# Altium schematic sheet Pack_monitoring.SchDoc
size 279 x 215 mm; Engineer: Andrew Chai; Revision: 1
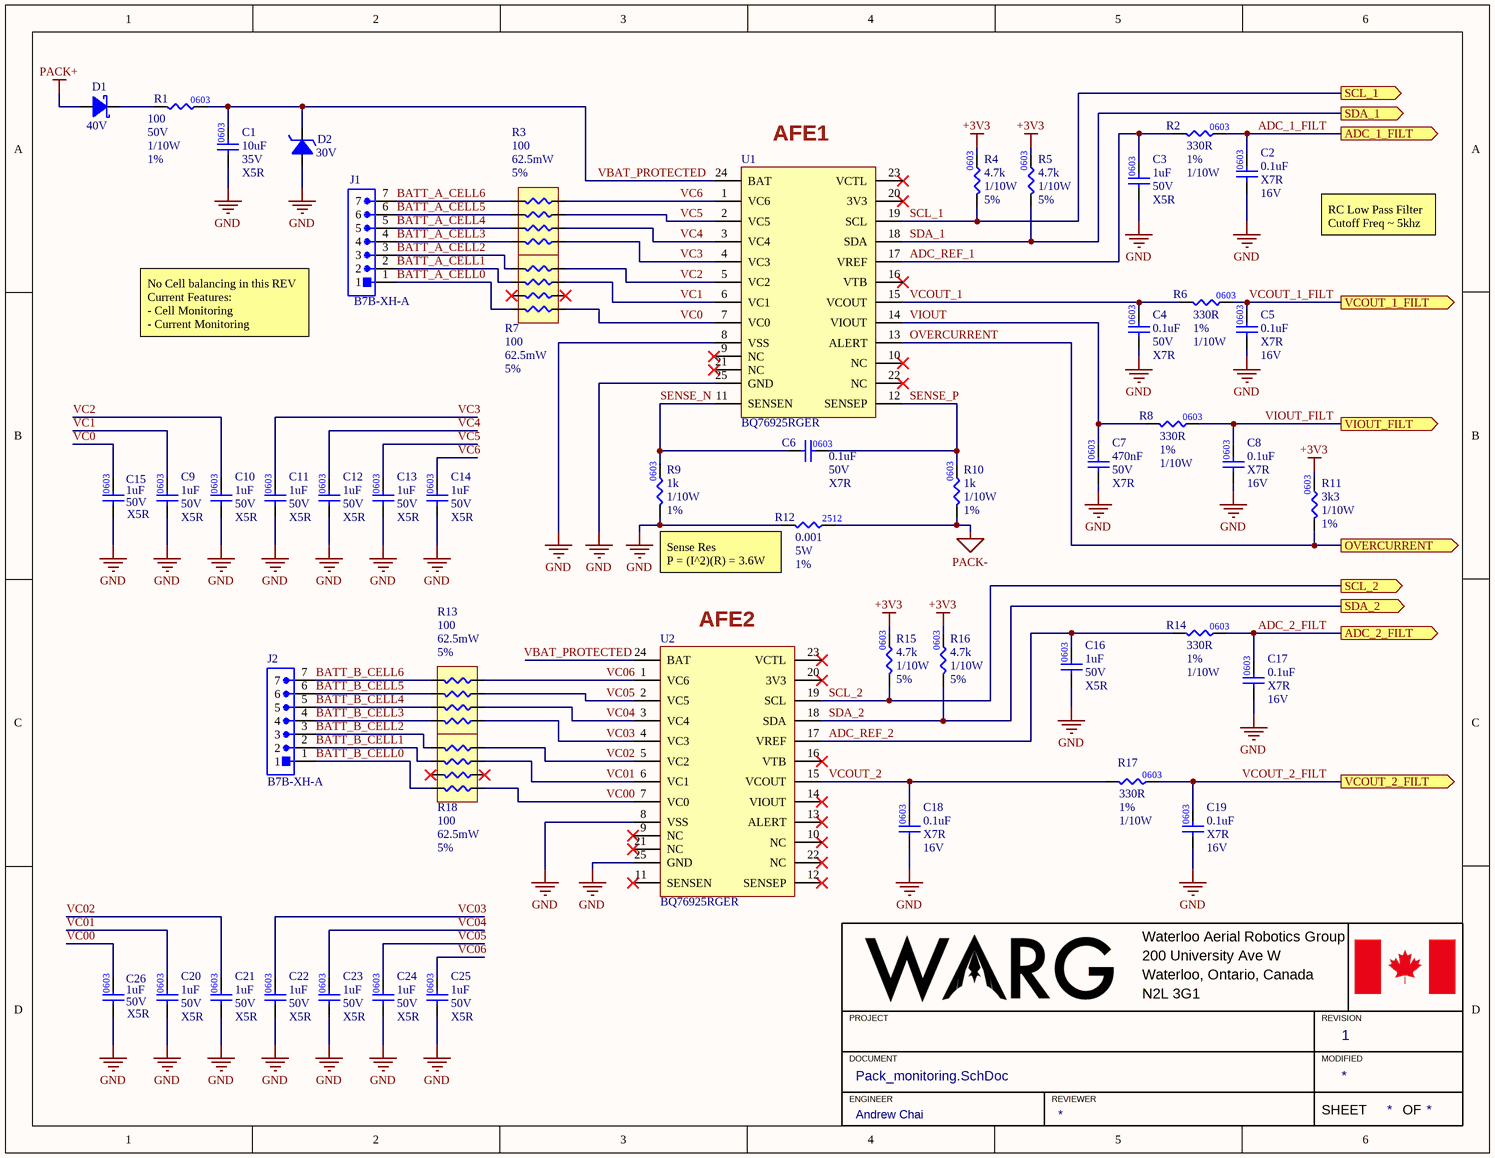
[diagram p0: Pack_monitoring.SchDoc]

## Parts
C1  value 10uF  Rated DC Voltage (URdc): 35V  Temperature Characteristics Code: X5R  [.CAP_0603-Footprint-1]  (hidden comment: GRM188R6YA106MA73J)
C2  value 0.1uF  Temperature Coefficient: X7R  Voltage: 16V  [.CAP_0603-Footprint-1]  (hidden comment: GCM188R71C104KA37D)
C3  value 1uF  Voltage Rating: 50V  Temperature Characteristics Code: X5R  [.CAP_0603-Footprint-1]  (hidden comment: GRT188R61H105KE13D)
C4  Voltage: 50V  Dielectric: X7R  Capacitance: 0.1uF  [CAP0603]  (hidden comment: GCM188R71H104KA57D)
C5  value 0.1uF  Temperature Coefficient: X7R  Voltage: 16V  [.CAP_0603-Footprint-1]  (hidden comment: GCM188R71C104KA37D)
C6  Voltage: 50V  Dielectric: X7R  Capacitance: 0.1uF  [CAP0603]  (hidden comment: GCM188R71H104KA57D)
C7  Dielectric: X7R  Capacitance: 470nF  Voltage Rating: 50V  [FP-0603-L_1_6_0_1-W_0_8_0-IPC_A]  (hidden comment: UMK107B7474KA-TR)
C8  value 0.1uF  Temperature Coefficient: X7R  Voltage: 16V  [.CAP_0603-Footprint-1]  (hidden comment: GCM188R71C104KA37D)
C9  value 1uF  Voltage Rating: 50V  Temperature Characteristics Code: X5R  [.CAP_0603-Footprint-1]  (hidden comment: GRT188R61H105KE13D)
C10  value 1uF  Voltage Rating: 50V  Temperature Characteristics Code: X5R  [.CAP_0603-Footprint-1]  (hidden comment: GRT188R61H105KE13D)
C11  value 1uF  Voltage Rating: 50V  Temperature Characteristics Code: X5R  [.CAP_0603-Footprint-1]  (hidden comment: GRT188R61H105KE13D)
C12  value 1uF  Voltage Rating: 50V  Temperature Characteristics Code: X5R  [.CAP_0603-Footprint-1]  (hidden comment: GRT188R61H105KE13D)
C13  value 1uF  Voltage Rating: 50V  Temperature Characteristics Code: X5R  [.CAP_0603-Footprint-1]  (hidden comment: GRT188R61H105KE13D)
C14  value 1uF  Voltage Rating: 50V  Temperature Characteristics Code: X5R  [.CAP_0603-Footprint-1]  (hidden comment: GRT188R61H105KE13D)
C15  value 1uF  Voltage Rating: 50V  Temperature Characteristics Code: X5R  [.CAP_0603-Footprint-1]  (hidden comment: GRT188R61H105KE13D)
C16  value 1uF  Voltage Rating: 50V  Temperature Characteristics Code: X5R  [.CAP_0603-Footprint-1]  (hidden comment: GRT188R61H105KE13D)
C17  value 0.1uF  Temperature Coefficient: X7R  Voltage: 16V  [.CAP_0603-Footprint-1]  (hidden comment: GCM188R71C104KA37D)
C18  value 0.1uF  Temperature Coefficient: X7R  Voltage: 16V  [.CAP_0603-Footprint-1]  (hidden comment: GCM188R71C104KA37D)
C19  value 0.1uF  Temperature Coefficient: X7R  Voltage: 16V  [.CAP_0603-Footprint-1]  (hidden comment: GCM188R71C104KA37D)
C20  value 1uF  Voltage Rating: 50V  Temperature Characteristics Code: X5R  [.CAP_0603-Footprint-1]  (hidden comment: GRT188R61H105KE13D)
C21  value 1uF  Voltage Rating: 50V  Temperature Characteristics Code: X5R  [.CAP_0603-Footprint-1]  (hidden comment: GRT188R61H105KE13D)
C22  value 1uF  Voltage Rating: 50V  Temperature Characteristics Code: X5R  [.CAP_0603-Footprint-1]  (hidden comment: GRT188R61H105KE13D)
C23  value 1uF  Voltage Rating: 50V  Temperature Characteristics Code: X5R  [.CAP_0603-Footprint-1]  (hidden comment: GRT188R61H105KE13D)
C24  value 1uF  Voltage Rating: 50V  Temperature Characteristics Code: X5R  [.CAP_0603-Footprint-1]  (hidden comment: GRT188R61H105KE13D)
C25  value 1uF  Voltage Rating: 50V  Temperature Characteristics Code: X5R  [.CAP_0603-Footprint-1]  (hidden comment: GRT188R61H105KE13D)
C26  value 1uF  Voltage Rating: 50V  Temperature Characteristics Code: X5R  [.CAP_0603-Footprint-1]  (hidden comment: GRT188R61H105KE13D)
D1  Rep Pk Reverse Voltage-Max: 40V  [Copy of .SCHOTTKY-Footprint-1]  (hidden comment: MBR0540T1G)
D2  Reference Voltage-Nom: 30V  [BZT52C30-13-Footprint-1]  (hidden comment: BZT52C30-13)
J1  B7B-XH-A  [B7B-XH-A]
J2  B7B-XH-A  [B7B-XH-A]
R1  Resistance: 100  Voltage Rating (DC): 50V  Power Rating: 1/10W  Tolerance: 1%  [.RES_0603-Footprint-1]  (hidden comment: RC0603FR-07100RL)
R2  value 330R  Power: 1/10W  Tolerance: 1%  [.RES_0603-Footprint-1]  (hidden comment: AF0603FR-07330RL)
R3  value 100  Power: 62.5mW  Tolerance: 5%  [.RES_0603-Footprint-1]  (hidden comment: YC124JR-07100RL)
R4  value 4.7k  Resistance Tolerance: 5%  Power Rating: 1/10W  [.RES_0603-Footprint-1]  (hidden comment: RC0603JR-074K7L)
R5  value 4.7k  Resistance Tolerance: 5%  Power Rating: 1/10W  [.RES_0603-Footprint-1]  (hidden comment: RC0603JR-074K7L)
R6  value 330R  Power: 1/10W  Tolerance: 1%  [.RES_0603-Footprint-1]  (hidden comment: AF0603FR-07330RL)
R7  value 100  Power: 62.5mW  Tolerance: 5%  [.RES_0603-Footprint-1]  (hidden comment: YC124JR-07100RL)
R8  value 330R  Power: 1/10W  Tolerance: 1%  [.RES_0603-Footprint-1]  (hidden comment: AF0603FR-07330RL)
R9  value 1k  Power: 1/10W  Tolerance: 1%  [.RES_0603-Footprint-1]  (hidden comment: RC0603FR-071KL)
R10  value 1k  Power: 1/10W  Tolerance: 1%  [.RES_0603-Footprint-1]  (hidden comment: RC0603FR-071KL)
R11  value 3k3  Power: 1/10W  Tolerance: 1%  [.RES_0603-Footprint-1]  (hidden comment: RC0603FR-103K3L)
R12  value 0.001  Tolerance: 1%  Power: 5W  [.RES_0603-Footprint-1]  (hidden comment: CSS2H-2512R-1L00F)
R13  value 100  Power: 62.5mW  Tolerance: 5%  [.RES_0603-Footprint-1]  (hidden comment: YC124JR-07100RL)
R14  value 330R  Power: 1/10W  Tolerance: 1%  [.RES_0603-Footprint-1]  (hidden comment: AF0603FR-07330RL)
R15  value 4.7k  Resistance Tolerance: 5%  Power Rating: 1/10W  [.RES_0603-Footprint-1]  (hidden comment: RC0603JR-074K7L)
R16  value 4.7k  Resistance Tolerance: 5%  Power Rating: 1/10W  [.RES_0603-Footprint-1]  (hidden comment: RC0603JR-074K7L)
R17  value 330R  Power: 1/10W  Tolerance: 1%  [.RES_0603-Footprint-1]  (hidden comment: AF0603FR-07330RL)
R18  value 100  Power: 62.5mW  Tolerance: 5%  [.RES_0603-Footprint-1]  (hidden comment: YC124JR-07100RL)
U1  BQ76925RGER  [QFN50P400X400X100_HS-25N]
U2  BQ76925RGER  [QFN50P400X400X100_HS-25N]

## Ports
ADC_1_FILT (out), ADC_2_FILT (out), OVERCURRENT (out), SCL_1 (out), SCL_2 (out), SDA_1 (out), SDA_2 (out), VCOUT_1_FILT (out), VCOUT_2_FILT (out), VIOUT_FILT (out)

## Nets
+3V3: R4.2 R5.2 R11.2 R15.2 R16.2
GND: C1.1 C2.1 C3.1 C4.1 C5.1 C7.1 C8.1 C9.1 C10.1 C11.1 C12.1 C13.1 C14.1 C15.1 C16.1 C17.1 C18.1 C19.1 C20.1 C21.1 C22.1 C23.1 C24.1 C25.1 C26.1 D2.1(Anode) R9.1 R12.1 U1.8(VSS) U1.25(GND) U2.8(VSS) U2.25(GND)
PACK+: D1.1(Anode)
PACK-: R10.1 R12.2
ADC_1_FILT: C2.2 R2.2 ; port ADC_1_FILT
ADC_2_FILT: C17.2 R14.2 ; port ADC_2_FILT
ADC_REF_1: C3.2 R2.1 U1.17(VREF)
ADC_REF_2: C16.2 R14.1 U2.17(VREF)
BATT_A_CELL0: J1.1 R7.7
BATT_A_CELL1: J1.2 R7.3
BATT_A_CELL2: J1.3 R7.1
BATT_A_CELL3: J1.4 R3.7
BATT_A_CELL4: J1.5 R3.5
BATT_A_CELL5: J1.6 R3.3
BATT_A_CELL6: J1.7 R3.1
BATT_B_CELL0: J2.1 R18.7
BATT_B_CELL1: J2.2 R18.3
BATT_B_CELL2: J2.3 R18.1
BATT_B_CELL3: J2.4 R13.7
BATT_B_CELL4: J2.5 R13.5
BATT_B_CELL5: J2.6 R13.3
BATT_B_CELL6: J2.7 R13.1
OVERCURRENT: R11.1 U1.13(ALERT) ; port OVERCURRENT
SCL_1: R4.1 U1.19(SCL) ; port SCL_1
SCL_2: R15.1 U2.19(SCL) ; port SCL_2
SDA_1: R5.1 U1.18(SDA) ; port SDA_1
SDA_2: R16.1 U2.18(SDA) ; port SDA_2
SENSE_N: C6.1 R9.2 U1.11(SENSEN)
SENSE_P: C6.2 R10.2 U1.12(SENSEP)
VBAT_PROTECTED: C1.2 D2.2(Cathode) R1.2 U1.24(BAT) U2.24(BAT)
VC0: C15.2 R7.8 U1.7(VC0)
VC00: C26.2 R18.8 U2.7(VC0)
VC1: C9.2 R7.4 U1.6(VC1)
VC01: C20.2 R18.4 U2.6(VC1)
VC2: C10.2 R7.2 U1.5(VC2)
VC02: C21.2 R18.2 U2.5(VC2)
VC3: C11.2 R3.8 U1.4(VC3)
VC03: C22.2 R13.8 U2.4(VC3)
VC4: C12.2 R3.6 U1.3(VC4)
VC04: C23.2 R13.6 U2.3(VC4)
VC5: C13.2 R3.4 U1.2(VC5)
VC05: C24.2 R13.4 U2.2(VC5)
VC6: C14.2 R3.2 U1.1(VC6)
VC06: C25.2 R13.2 U2.1(VC6)
VCOUT_1: C4.2 R6.1 U1.15(VCOUT)
VCOUT_1_FILT: C5.2 R6.2 ; port VCOUT_1_FILT
VCOUT_2: C18.2 R17.1 U2.15(VCOUT)
VCOUT_2_FILT: C19.2 R17.2 ; port VCOUT_2_FILT
VIOUT: C7.2 R8.1 U1.14(VIOUT)
VIOUT_FILT: C8.2 R8.2 ; port VIOUT_FILT
NetD1_2: D1.2(Cathode) R1.1

Not connected (* = marked no-connect by the designer): R7 5* 6*; R18 5* 6*; U1 9(NC)* 10(NC)* 16(VTB)* 20(3V3)* 21(NC)* 22(NC)* 23(VCTL)*; U2 9(NC)* 10(NC)* 11(SENSEN)* 12(SENSEP)* 13(ALERT)* 14(VIOUT)* 16(VTB)* 20(3V3)* 21(NC)* 22(NC)* 23(VCTL)*

## Notes on the sheet
- (near U1) AFE1
- RC Low Pass Filter
  Cutoff Freq ~ 5khz
- No Cell balancing in this REV
  Current Features:
  - Cell Monitoring
  - Current Monitoring
- (near R12) Sense Res
  P = (I^2)(R) = 3.6W
- (near U2) AFE2
- Waterloo Aerial Robotics Group
- 200 University Ave W
- PROJECT
- Waterloo, Ontario, Canada
- N2L 3G1
- REVISION
- DOCUMENT
- ENGINEER
- REVIEWER
- MODIFIED
- SHEET
- OF

## Library data of the parts
C1 = CMP-001-00087-1: Ceramic Capacitor, Multilayer, Ceramic, 35V, 20% +Tol, 20% -Tol, X5R, 15% TC, 10uF, Surface Mount, 0603; Multilayer: Yes; Reach SVHC Compliant: Yes; Pins: 2; Tolerance (fill in as +-): 20%; Capacitor Type: Ceramic; JESD-609 Code: e3; Case/Package: 0603; RoHS Compliant: Yes; Package Shape: Rectangular; Tolerance  (fill in as +-): 20%; Dielectric Material: Ceramic; Min Operating Temperature: -55°C; Max Operating Temperature: 85°C; Packaging: Tape and Reel; Terminal Finish: Nickel; Termination: Wraparound; Mounting Technology: Surface Mount
C2 C5 C8 C17-C19 = CMP-001-00020-5: CAP CER 0.1uF 16V X7R 0603; Capactitance: 0.1uF; Package: 0603
C3 C9-C16 C20-C26 = CMP-00096-3: CAP CER 1UF 50V X5R 0603; Tolerance: 10%; Capacitor Type: Ceramic; Dielectric: X5R; Mount: Surface Mount; Capacitance: 1uF; Case/Package: 0603; Rated DC Voltage (URdc): 50V
C4 C6 = CMP-00047-2: CAP CER 0.1uF 50V X7R 0603; Tolerance: 10%; Mount: Surface Mount; Case Code (Imperial): 0603
C7 = CMP-00012-3: 0603 0.47 uF 50 V ±10% Tolerance X7R Multilayer Ceramic Capacitor; Tolerance: 10%; Case Code (Metric): 1608; Width: 0.031inch; Voltage: 50V; Voltage Rating (DC): 50V; Height: 0.8mm; Termination: SMD/SMT; Construction: Flat; Depth: 0.8mm; Max Operating Temperature: 125°C; Case Code (Imperial): 0603; Length: 1.6mm; Mount: Surface Mount; Radiation Hardening: No; Packaging: Tape and Reel; RoHS Compliant: Yes; Series: M; Thickness: 0.035inch; Lead Free: Lead Free; Min Operating Temperature: -55°C; Package Quantity: 1; Halogen Free: Halogen Free; Case/Package: 0603
D1 = CMP-004-00020-1: DIODE SCHOTTKY 40V 500MA SOD123; Forward Voltage: 620mV; Number of Elements: 1; Package Body Material: Plastic; Non-rep Pk Forward Current-Max: 5.5A; Diode Type: RECTIFIER; Time @ Peak Reflow Temperature-Max (s): 40s; Diode Element Material: SILICON; Qualification Status: Not Qualified; Additional Feature: FREE WHEELING DIODE; Pins: 2; Min Operating Temperature: -55°C; Reach SVHC Compliant: Yes; Surface Mount: Yes; RoHS Compliant: Yes; Peak Reflow Temperature (Cel): 260°C; Max Operating Temperature: 150°C; Moisture Sensitivity Level: 1; Terminal Position: DUAL; Package Style: SMALL OUTLINEMeter; JESD-609 Code: e3; JESD-30 Code: R-PDSO-G2; Package Shape: Rectangular; Terminal Finish: Tin; Terminal Form: Gull Wing; Technology: SCHOTTKY; Max Output current: 500mA
D2 = CMP-004-00021-1: Zener Diode, 30V V(Z), 6.67%, 0.5W, Silicon, Unidirectional; Max Power Dissipation: 500mW; Time @ Peak Reflow Temperature-Max (s): 10s; Package Body Material: Plastic; Test Current: 2mA; Number of Elements: 1; Qualification Status: Not Qualified; Voltage Tol-Max: 6.67%; Diode Type: ZENER; JESD-30 Code: R-PDSO-G2; Terminal Position: DUAL; Surface Mount: Yes; Pins: 2; Diode Element Material: SILICON; Technology: ZENER; Package Shape: Rectangular; Terminal Form: Gull Wing; Peak Reflow Temperature (Cel): 235°C; Terminal Finish: Tin; Polarity: Unidirectional; Package Style: SMALL OUTLINEMeter; Max Operating Temperature: 150°C; JESD-609 Code: e0; Min Operating Temperature: -65°C; RoHS Compliant: No
J1 J2 = CMP-002-00021-4: Header B7B-XH-A, 2.50mm, 7-contacts, top entry, THT /500/box; MF: JST Sales; MP: B7B-XH-A; Design Item ID: B7B-XH-A; Pin Count: 7; Check_prices: https://www.snapeda.com/parts/S5B-XH-A/JST+Sales+America+Inc./view-part/?ref=eda; Component Type: Standard; Package: None
R1 = CMP-00022-3: RES 100 OHM 1% 1/10W 0603; Temperature Coefficient: 100ppm/°C; Max Power Dissipation: 100mW; Case Code (Imperial): 0603; Lead Free: Lead Free; Resistance Tolerance: 1%; Height: 0.45mm; Min Operating Temperature: -55°C; Case Code (Metric): 1608; Technology: THICK FILM; Max Operating Temperature: 155°C; Military Standard: Not; Length: 1.6mm; Width: 0.8mm; Number of Terminations: 2; Construction: Rectangular; Features: Moisture Resistant; REACH SVHC: Unknown; Series: RC; Depth: 0.8mm; Voltage Rating: 50V; Resistor Type: Thick Film; RoHS Compliant: Yes; Case/Package: 0603; Size Code: 0603; Termination: SMD/SMT; Packaging: Tape and Reel; Number of Pins: 2
R2 R6 R8 R14 R17 = CMP-009-00099-1: Fixed Resistor, Metal Glaze/thick Film, 0.1W, 330ohm, 75V, 1% +/-Tol, 100ppm/Cel, Surface Mount, 0603; Resistance: 330; Reference Standard: AEC-Q200; Rated Temperature: 70°C; Package Width: 0.8mm; Package Length: 1.6mm; Additional Feature: ANTI-SULFUR; Package Height: 0.45mm; Temperature Coefficient: 100ppm/°C; Case/Package: 0603; Reach SVHC Compliant: Yes; Working Voltage: 75V; Package Style: SMTMeter; Mounting Technology: Surface Mount; Package: 0603; Resistor Type: FIXED RESISTOR; Max Operating Temperature: 155°C; Pins: 2; Termination: Wraparound; Min Operating Temperature: -55°C; RoHS Compliant: Yes; Packaging: Tape and Reel; Construction: Rectangular
R3 R7 R13 R18 = CMP-009-00095-1: YC124 Series 4 Elements 100 Ohms 5 % Case 4 x 0402 SMD Chip Resistor Network; Package: 0804; Resistance: 100
R4 R5 R15 R16 = CMP-009-00019-3: RES 4.7K OHM 5% 1/10W 0603; Voltage Rating (DC): 50V; Case/Package: 0603; Resistance: 4.7k
R9 R10 = CMP-009-00012-3: RES 1k OHM 1% 1/10W 0603; Case/Package: 0603
R11 = CMP-00168-2: RES 3.3K OHM 1% 1/10W 0603; Rated Temperature: 70°C; Working Voltage: 75V; Case/Package: 0603
R12 = CMP-009-00094-1: Fixed Resistor, Metal Strip, 5W, 0.001ohm, 1% +/-Tol, 50ppm/Cel, Surface Mount, 2512; Package Length: 6.35mm; Temperature Coefficient: 50ppm/°C; Package Width: 3.05mm; Package Height: 0.42mm; Resistance: 0.001; Package Shape: Rectangular; Min Operating Temperature: -55°C; Packaging: Tape and Reel; Technology: METAL ALLOY; Package Style: SMTMeter; Case/Package: 2512; Max Operating Temperature: 170°C; Package: 2512; RoHS Compliant: Yes; Resistor Type: FIXED RESISTOR; Pins: 2; Reach SVHC Compliant: Yes; Construction: Rectangular
U1 U2 = CMP-00274-1: Power Supply Support Circuit, Adjustable, 1 Channel, PQCC24; Qualification Status: Not Qualified; Adjustable Threshold: Yes; Max Supply Voltage: 26.4V; Nominal Supply Voltage: 21.6V; Package Body Material: Plastic; Number of Channels: 1; Supply Current-Max (Isup): 48uA; Power Supplies: 4.2/26.4V; Package Equivalence Code: LCC24,.16SQ,20; Min Supply Voltage: 4.2V; RoHS Compliant: Yes; Surface Mount: Yes; Terminal Pitch: 0.5mm; Terminal Finish: Nickel; Min Operating Temperature: -25°C; Throw Configuration: POWER SUPPLY SUPPORT CIRCUIT; Reach SVHC Compliant: Yes; JESD-30 Code: R-PDSO-G20; Width: 4mm; Case/Package: HVQCCN; JESD-609 Code: e4; Pins: 24; Peak Reflow Temperature (Cel): 260°C; Height - Seated (Max): 1mm; Channels: 1; Length: 4mm; Package Shape: Square; Max Operating Temperature: 85°C; Temperature Grade: OTHER; Moisture Sensitivity Level: 2; Terminal Form: No Lead; Terminal Position: QUAD; Package Style: CHIP CARRIER, HEAT SINK/SLUG, VERY THIN PROFILEMeter